# Altium schematic sheet 0-Hierarchy.SchDoc
size A4; Author: Fabian Castaño; CompanyName: GIBIC Tech-Hub; Engineer: Fabian Castaño; Organization: Universidad de Antioquia; Address1: UdeA; Address2: Medellín; Address3: Antioquia; Address4: Colombia 050010; DocumentNumber: 1; SheetNumber: 1; SheetTotal: 4
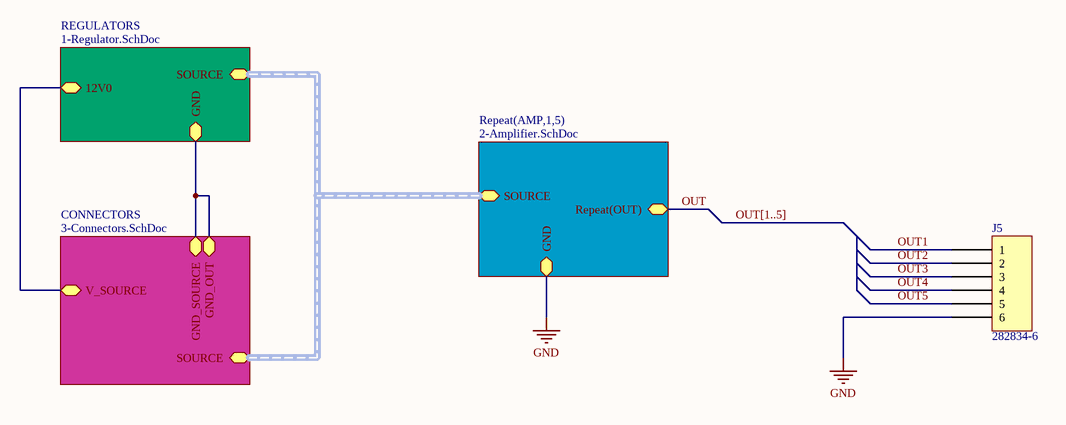
[diagram p0: 0-Hierarchy.SchDoc]

## Parts
J5  282834-6  [TE 282834-6]

## Sub-sheets
CONNECTORS = 3-Connectors.SchDoc: V_SOURCE, GND_SOURCE, GND_OUT, SOURCE (harness SUP_HAR)
REGULATORS = 1-Regulator.SchDoc: 12V0, GND, SOURCE (harness SUP_HAR)
Repeat(AMP,1,5) = 2-Amplifier.SchDoc: SOURCE (harness SUP_HAR), Repeat(OUT), GND

## Nets
GND: J5.6 ; sheet Repeat(AMP,1,5)/GND
OUT: sheet Repeat(AMP,1,5)/Repeat(OUT)
OUT1: J5.1
OUT2: J5.2
OUT3: J5.3
OUT4: J5.4
OUT5: J5.5
(unnamed): sheet REGULATORS/12V0, sheet CONNECTORS/V_SOURCE
(unnamed): sheet REGULATORS/GND, sheet CONNECTORS/GND_SOURCE, sheet CONNECTORS/GND_OUT

## Buses and harness runs
bus OUT[1..5]
harness sheet CONNECTORS/SOURCE = sheet REGULATORS/SOURCE = sheet Repeat(AMP,1,5)/SOURCE

## Notes on the sheet
- Notes
- Title
- Size:
- Date:
- A4
- Number:
- Time:
- Revision:
- Sheet
- of
- File:

## Library data of the parts
J5 = 282834-6: TERM BLK 6P SIDE ENT 2.54MM PCB; Manufacturer: TE Connectivity AMP Connectors; Current: 10A; Mating Orientation: Horizontal with Board; Number of Levels: 1; Pitch: 0.100" (2.54mm); Positions Per Level: 6; Voltage: 150V; Wire Gauge: 16-30 AWG; Wire Termination: Screw - Rising Cage Clamp; Part Number: 282834-6; Color: Green; ComponentLink1Description: Datasheet; ComponentLink1URL: https://www.te.com/commerce/DocumentDelivery/DDEController?Action=srchrtrv&DocNm=282834&DocType=Customer+Drawing&DocLang=English; ComponentLink2Description: DigiKey Link; ComponentLink2URL: http://digikey.com/product-detail/en/te-connectivity-amp-connectors/282834-6/A98337-ND/1153267; LastUpdated: 15/01/2020 04:16:31; Lifecycle Status: Active; Minimum Order: 1; Mounting Type: Through Hole; Packaging: Bulk; Part Status: Active; Price: 4.72; Series: Buchanan; Supplier 1: DigiKey; Supplier Part Number 1: A98337-ND